# Altium schematic sheet Microcontroller.SchDoc: CH1 INPUT
size A4; Author: MOG; CompanyName: GIE GROUP; DrawnBy: MOG; Organization: Gie SA; Address1: Galicia 52; Address2: Mar del Plata; Address3: Buenos Aires; Address4: Argentina; DocumentNumber: 1; Revision: 0.0; SheetNumber: 10; SheetTotal: 11; Project: CP DATALOGGER; PageSetup: Record=PageOptions|CenterHorizontal=True|CenterVertical=True|PrintScale=0.94|XCorrection=1.00|YCorrection=1.00|PrintKind=0|BorderSize=5000000|LeftOffset=0|BottomOffset=0|Orientation=2|PaperLength=1000|PaperWidth=1000|Scale=100|PaperSource=7|PrintQuality=720|MediaType=1|DitherType=10|PaperKind=A4|PrintScaleMode=1
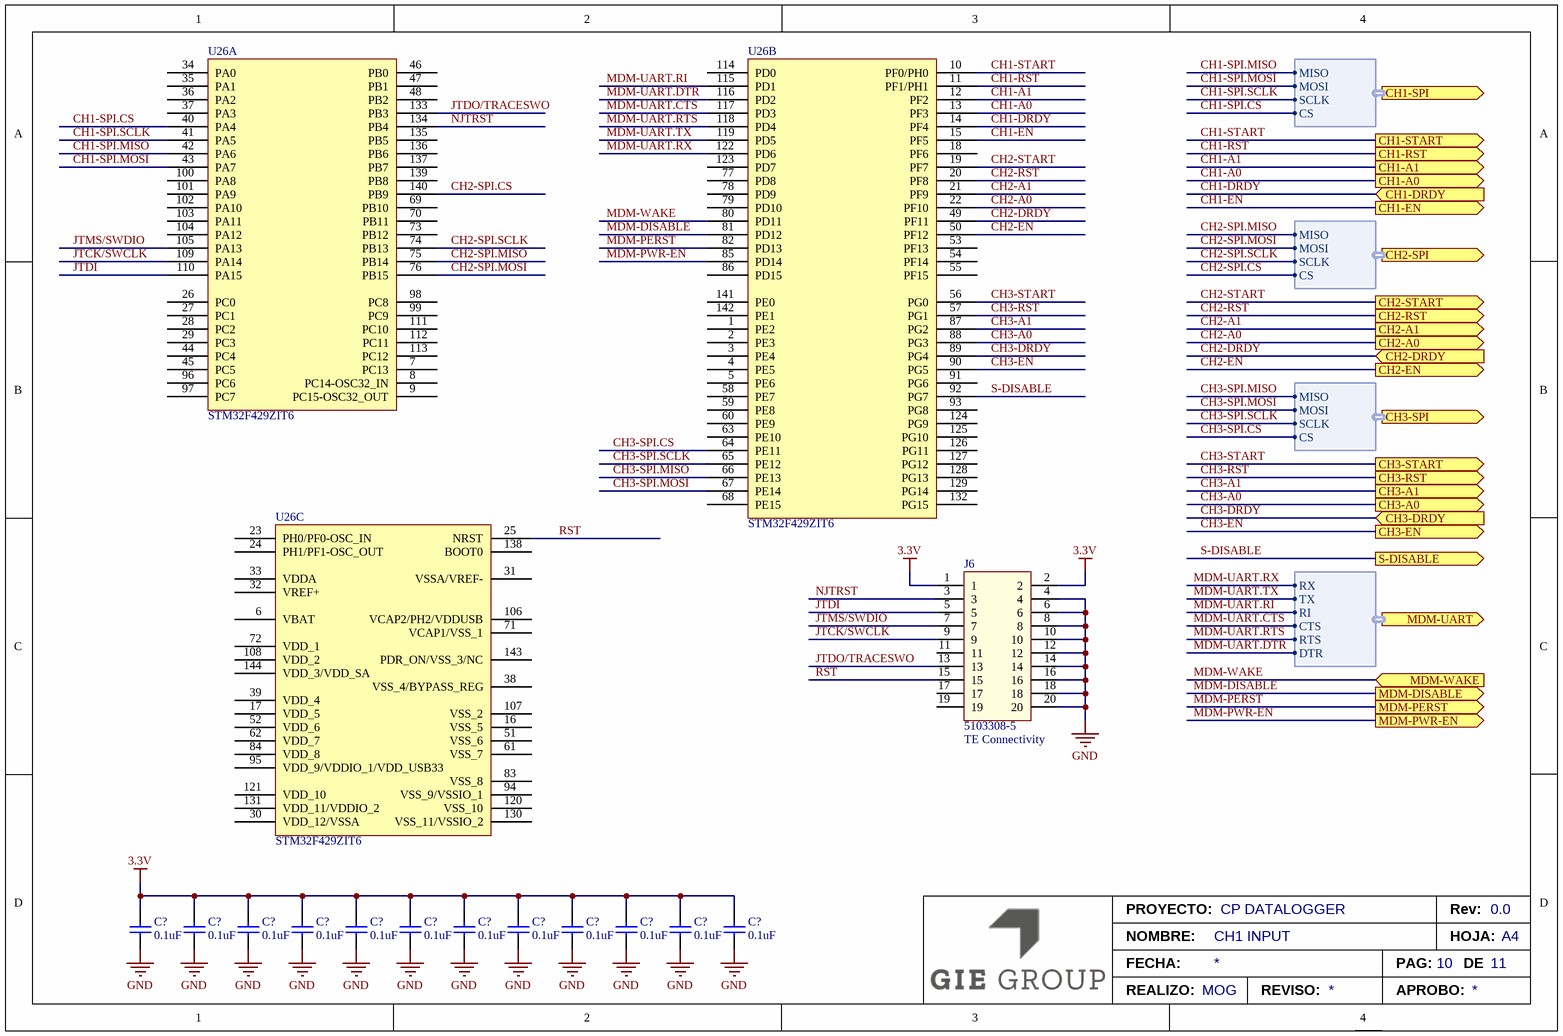
[diagram p0: Microcontroller.SchDoc]

## Parts
(Parts that share a designator on the sheet are numbered #1, #2 ... from top to bottom, then left to right.)
C?#1  value 0.1uF  [CAP-0603]  (hidden comment: C0603C104K5RACAUTO)
C?#2  value 0.1uF  [CAP-0603]  (hidden comment: C0603C104K5RACAUTO)
C?#3  value 0.1uF  [CAP-0603]  (hidden comment: C0603C104K5RACAUTO)
C?#4  value 0.1uF  [CAP-0603]  (hidden comment: C0603C104K5RACAUTO)
C?#5  value 0.1uF  [CAP-0603]  (hidden comment: C0603C104K5RACAUTO)
C?#6  value 0.1uF  [CAP-0603]  (hidden comment: C0603C104K5RACAUTO)
C?#7  value 0.1uF  [CAP-0603]  (hidden comment: C0603C104K5RACAUTO)
C?#8  value 0.1uF  [CAP-0603]  (hidden comment: C0603C104K5RACAUTO)
C?#9  value 0.1uF  [CAP-0603]  (hidden comment: C0603C104K5RACAUTO)
C?#10  value 0.1uF  [CAP-0603]  (hidden comment: C0603C104K5RACAUTO)
C?#11  value 0.1uF  [CAP-0603]  (hidden comment: C0603C104K5RACAUTO)
C?#12  value 0.1uF  [CAP-0603]  (hidden comment: C0603C104K5RACAUTO)
J6  Manufacturer: TE Connectivity  [TE-5103308-5]  (hidden comment: 5103308-5)
U26  STM32F429ZIT6  [LQFP144]  (parts A,B,C of 3)

## Ports
CH1-A0 (out), CH1-A1 (out), CH1-DRDY (in), CH1-EN (out), CH1-RST (out), CH1-SPI (out, harness CH1-SPI), CH1-START (out), CH2-A0 (out), CH2-A1 (out), CH2-DRDY (in), CH2-EN (out), CH2-RST (out), CH2-SPI (out, harness CH2-SPI), CH2-START (out), CH3-A0 (out), CH3-A1 (out), CH3-DRDY (in), CH3-EN (out), CH3-RST (out), CH3-SPI (out, harness CH3-SPI), CH3-START (out), MDM-DISABLE (out), MDM-PERST (out), MDM-PWR-EN (out), MDM-UART (out, harness MDM-UART), MDM-WAKE (in), S-DISABLE (out)

## Harnesses
CH1-SPI: MOSI, MISO, SCLK, CS
CH2-SPI: MOSI, MISO, SCLK, CS
CH3-SPI: MOSI, MISO, SCLK, CS
MDM-UART: RX, TX, RI, CTS, RTS, DTR

## Nets
3.3V: C?#1.2 C?#2.2 C?#3.2 C?#4.2 C?#5.2 C?#6.2 C?#7.2 C?#8.2 C?#9.2 C?#10.2 C?#11.2 C?#12.2 J6.1 J6.2
GND: C?#1.1 C?#2.1 C?#3.1 C?#4.1 C?#5.1 C?#6.1 C?#7.1 C?#8.1 C?#9.1 C?#10.1 C?#11.1 C?#12.1 J6.4 J6.6 J6.8 J6.10 J6.12 J6.14 J6.16 J6.18 J6.20
CH1-A0: U26.13(PF3) ; port CH1-A0
CH1-A1: U26.12(PF2) ; port CH1-A1
CH1-DRDY: U26.14(PF4) ; port CH1-DRDY
CH1-EN: U26.15(PF5) ; port CH1-EN
CH1-RST: U26.11(PF1/PH1) ; port CH1-RST
CH1-SPI.CS: U26.40(PA4) ; port CH1-SPI.CS
CH1-SPI.MISO: U26.42(PA6) ; port CH1-SPI.MISO
CH1-SPI.MOSI: U26.43(PA7) ; port CH1-SPI.MOSI
CH1-SPI.SCLK: U26.41(PA5) ; port CH1-SPI.SCLK
CH1-START: U26.10(PF0/PH0) ; port CH1-START
CH2-A0: U26.22(PF10) ; port CH2-A0
CH2-A1: U26.21(PF9) ; port CH2-A1
CH2-DRDY: U26.49(PF11) ; port CH2-DRDY
CH2-EN: U26.50(PF12) ; port CH2-EN
CH2-RST: U26.20(PF8) ; port CH2-RST
CH2-SPI.CS: U26.140(PB9) ; port CH2-SPI.CS
CH2-SPI.MISO: U26.75(PB14) ; port CH2-SPI.MISO
CH2-SPI.MOSI: U26.76(PB15) ; port CH2-SPI.MOSI
CH2-SPI.SCLK: U26.74(PB13) ; port CH2-SPI.SCLK
CH2-START: U26.19(PF7) ; port CH2-START
CH3-A0: U26.88(PG3) ; port CH3-A0
CH3-A1: U26.87(PG2) ; port CH3-A1
CH3-DRDY: U26.89(PG4) ; port CH3-DRDY
CH3-EN: U26.90(PG5) ; port CH3-EN
CH3-RST: U26.57(PG1) ; port CH3-RST
CH3-SPI.CS: U26.64(PE11) ; port CH3-SPI.CS
CH3-SPI.MISO: U26.66(PE13) ; port CH3-SPI.MISO
CH3-SPI.MOSI: U26.67(PE14) ; port CH3-SPI.MOSI
CH3-SPI.SCLK: U26.65(PE12) ; port CH3-SPI.SCLK
CH3-START: U26.56(PG0) ; port CH3-START
JTCK/SWCLK: J6.9 U26.109(PA14)
JTDI: J6.5 U26.110(PA15)
JTDO/TRACESWO: J6.13 U26.133(PB3)
JTMS/SWDIO: J6.7 U26.105(PA13)
MDM-DISABLE: U26.81(PD12) ; port MDM-DISABLE
MDM-PERST: U26.82(PD13) ; port MDM-PERST
MDM-PWR-EN: U26.85(PD14) ; port MDM-PWR-EN
MDM-UART.CTS: U26.117(PD3) ; port MDM-UART.CTS
MDM-UART.DTR: U26.116(PD2) ; port MDM-UART.DTR
MDM-UART.RI: U26.115(PD1) ; port MDM-UART.RI
MDM-UART.RTS: U26.118(PD4) ; port MDM-UART.RTS
MDM-UART.RX: U26.122(PD6) ; port MDM-UART.RX
MDM-UART.TX: U26.119(PD5) ; port MDM-UART.TX
MDM-WAKE: U26.80(PD11) ; port MDM-WAKE
NJTRST: J6.3 U26.134(PB4)
RST: J6.15 U26.25(NRST)
S-DISABLE: U26.92(PG7) ; port S-DISABLE

Not connected (* = marked no-connect by the designer): J6 11 17 19; U26 1(PE2) 2(PE3) 3(PE4) 4(PE5) 5(PE6) 6(VBAT) 7(PC13) 8(PC14-OSC32_IN) 9(PC15-OSC32_OUT) 16(VSS_5) 17(VDD_5) 18(PF6) 23(PH0/PF0-OSC_IN) 24(PH1/PF1-OSC_OUT) 26(PC0) 27(PC1) 28(PC2) 29(PC3) 30(VDD_12/VSSA) 31(VSSA/VREF-) 32(VREF+) 33(VDDA) 34(PA0) 35(PA1) 36(PA2) 37(PA3) 38(VSS_4/BYPASS_REG) 39(VDD_4) 44(PC4) 45(PC5) 46(PB0) 47(PB1) 48(PB2) 51(VSS_6) 52(VDD_6) 53(PF13) 54(PF14) 55(PF15) 58(PE7) 59(PE8) 60(PE9) 61(VSS_7) 62(VDD_7) 63(PE10) 68(PE15) 69(PB10) 70(PB11) 71(VCAP1/VSS_1) 72(VDD_1) 73(PB12) 77(PD8) 78(PD9) 79(PD10) 83(VSS_8) 84(VDD_8) 86(PD15) 91(PG6) 93(PG8) 94(VSS_9/VSSIO_1) 95(VDD_9/VDDIO_1/VDD_USB33) 96(PC6) 97(PC7) 98(PC8) 99(PC9) 100(PA8) 101(PA9) 102(PA10) 103(PA11) 104(PA12) 106(VCAP2/PH2/VDDUSB) 107(VSS_2) 108(VDD_2) 111(PC10) 112(PC11) 113(PC12) 114(PD0) 120(VSS_10) 121(VDD_10) 123(PD7) 124(PG9) 125(PG10) 126(PG11) 127(PG12) 128(PG13) 129(PG14) 130(VSS_11/VSSIO_2) 131(VDD_11/VDDIO_2) 132(PG15) 135(PB5) 136(PB6) 137(PB7) 138(BOOT0) 139(PB8) 141(PE0) 142(PE1) 143(PDR_ON/VSS_3/NC) 144(VDD_3/VDD_SA)

## Notes on the sheet
- PROYECTO:
- Rev:
- NOMBRE:
- FECHA:
- REALIZO:
- REVISO:
- APROBO:
- PAG:
- HOJA:
- DE
- A4

## Library data of the parts
C?#1-C?#12 = C0603C104K5RACAUTO: CAP CER 0.1uF 50V X7R 0603; Manufacturer: Kemet; Tolerance: 10%; Voltage: 50; PartNumber: C0603C104K5RACAUTO; Supplier 1: Digi-Key; Supplier 2: Mouser; Supplier Part Number 1: 399-6856-1-ND; Supplier Part Number 2: 80-C0603C104K5RAUTO
J6 = 5103308-5: CONN HEADER VERT 20POS 2.54MM; PartNumber: 5103308-5
U26 = STM32F429ZIT6: IC MCU 32BIT 2MB FLASH 144LQFP; Manufacturer: STMicroelectronics; PartNumber: STM32F429ZIT6